# Altium project Pulp FMC Sensor Board_8X64Mbits_HyperRam.PrjPcb
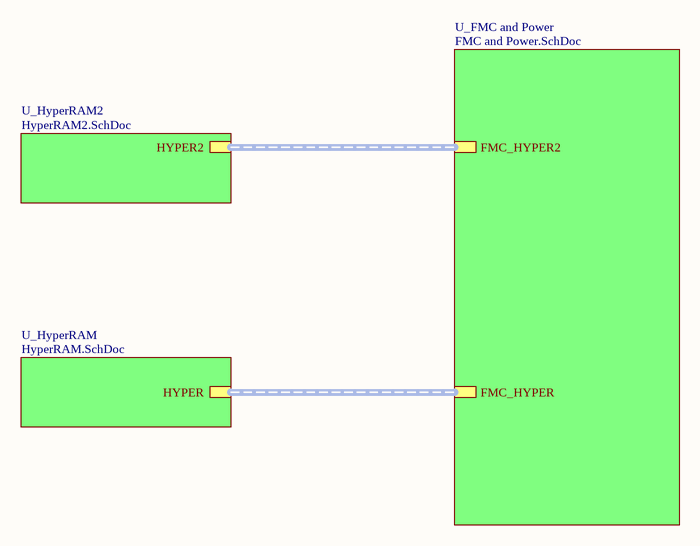
[diagram p0: Pulp FMC Sensor Board_8X64Mbits_HyperRam.SchDoc]
3 sheets, 36 parts. Net scope: hierarchical (ports join the sheet entries above them; power ports are global).
Board file: Pulp FMC Sensor Board_8X64Mbits_HyperRam.PcbDoc
Sheets:
  Pulp FMC Sensor Board_8X64Mbits_HyperRam.SchDoc
    U_HyperRAM = HyperRAM.SchDoc
    U_HyperRAM2 = HyperRAM2.SchDoc

## Sheet Pulp FMC Sensor Board_8X64Mbits_HyperRam.SchDoc: Pulp FMC Sensor Board_8X64Mbits_HyperRam
size A4; Author: A. Blanco Fontao; CompanyName: ETHZ; DrawnBy: A. Blanco Fontao; Organization: Microelectronics Design Center; Address1: Gloriastrasse 35; Address2: 8092 Zurich; Address3: Switzerland; SheetNumber: 1; SheetTotal: 7

### Sub-sheets
U_FMC and Power = FMC and Power.SchDoc (file not in this document): FMC_HYPER (harness HYPER), FMC_HYPER2
U_HyperRAM = HyperRAM.SchDoc: HYPER (harness HYPER)
U_HyperRAM2 = HyperRAM2.SchDoc: HYPER2

### Buses and harness runs
harness sheet U_FMC and Power/FMC_HYPER2 = sheet U_HyperRAM2/HYPER2
harness sheet U_FMC and Power/FMC_HYPER = sheet U_HyperRAM/HYPER

### Notes on the sheet
- 1
- 2
- 3
- 4
- A
- B
- C
- Project:
- D
- Date:
- Drawing number:
- Rev:
- Format:
- A4 Q
- Drawn by:
- Laboratory:
- Page
- Sheet:
- of
- File:

## Sheet HyperRAM.SchDoc: Pulp FMC Sensor Board
size A4; Author: A. Blanco Fontao; CompanyName: ETHZ; DrawnBy: A. Blanco Fontao; Organization: Microelectronics Design Center; Address1: Gloriastrasse 35; Address2: 8092 Zurich; Address3: Switzerland; SheetNumber: 4; SheetTotal: 7
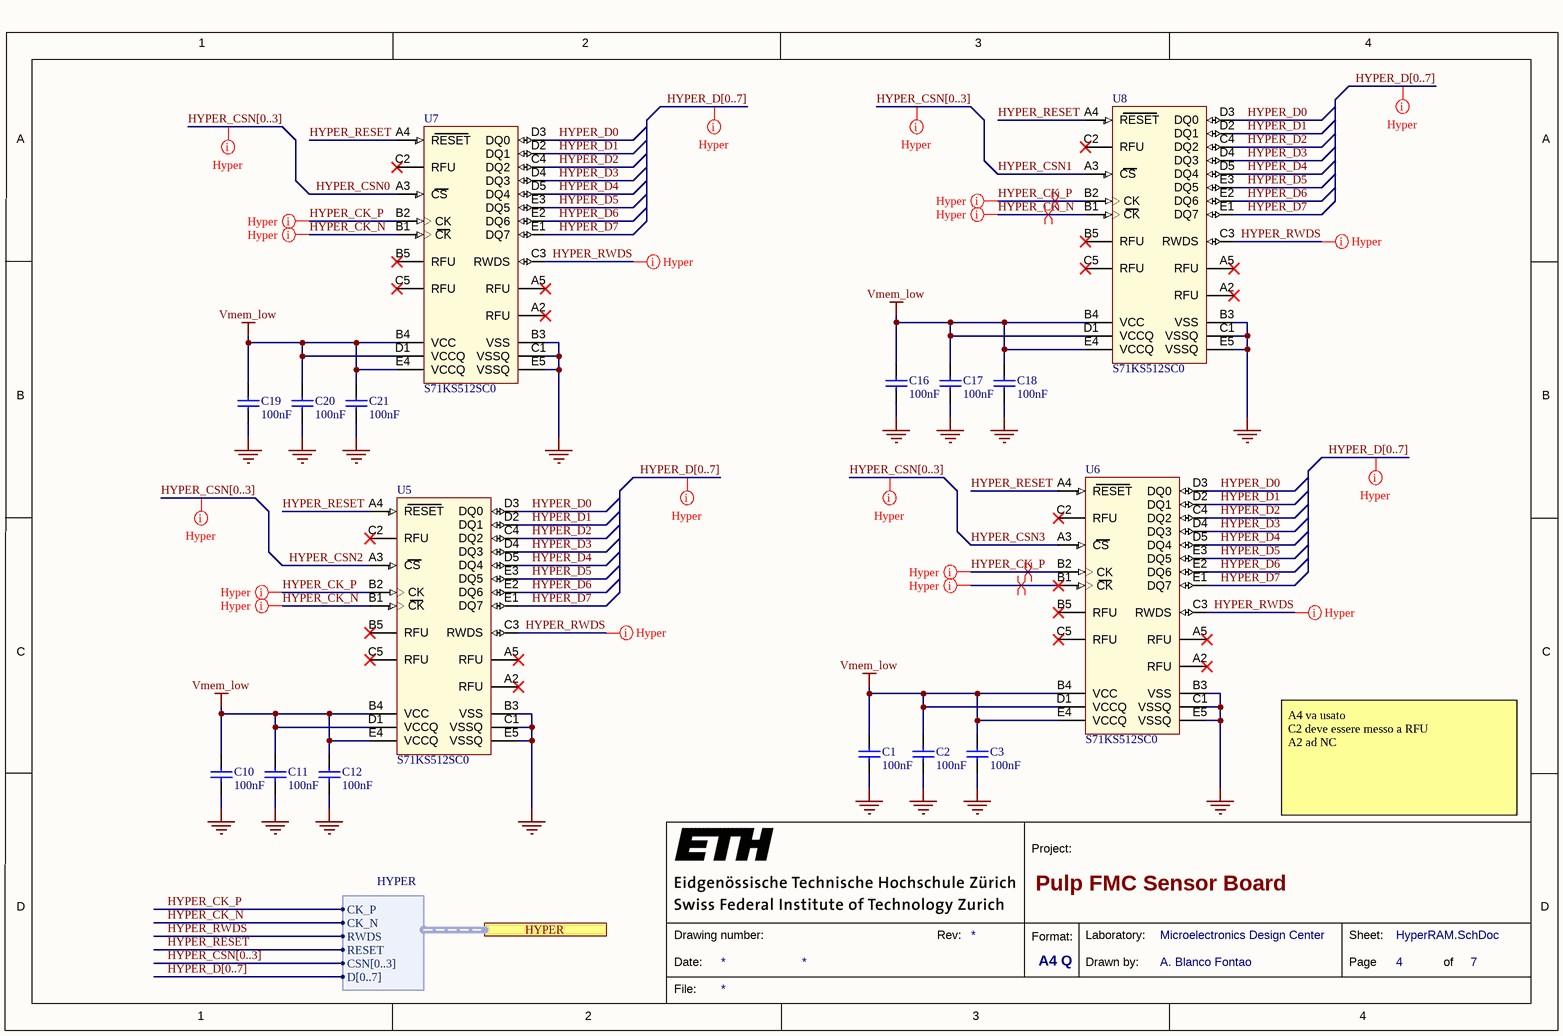
[diagram p1: HyperRAM.SchDoc]

### Parts
C1  value 100nF  [CAPC0603(1608)100_N]  (hidden comment: CAP 100nF 25V 0603(1608))
C2  value 100nF  [CAPC0603(1608)100_N]  (hidden comment: CAP 100nF 25V 0603(1608))
C3  value 100nF  [CAPC0603(1608)100_N]  (hidden comment: CAP 100nF 25V 0603(1608))
C10  value 100nF  [CAPC0603(1608)100_N]  (hidden comment: CAP 100nF 25V 0603(1608))
C11  value 100nF  [CAPC0603(1608)100_N]  (hidden comment: CAP 100nF 25V 0603(1608))
C12  value 100nF  [CAPC0603(1608)100_N]  (hidden comment: CAP 100nF 25V 0603(1608))
C16  value 100nF  [CAPC0603(1608)100_N]  (hidden comment: CAP 100nF 25V 0603(1608))
C17  value 100nF  [CAPC0603(1608)100_N]  (hidden comment: CAP 100nF 25V 0603(1608))
C18  value 100nF  [CAPC0603(1608)100_N]  (hidden comment: CAP 100nF 25V 0603(1608))
C19  value 100nF  [CAPC0603(1608)100_N]  (hidden comment: CAP 100nF 25V 0603(1608))
C20  value 100nF  [CAPC0603(1608)100_N]  (hidden comment: CAP 100nF 25V 0603(1608))
C21  value 100nF  [CAPC0603(1608)100_N]  (hidden comment: CAP 100nF 25V 0603(1608))
U5  S71KS512SC0  [FBGA24_A-130]
U6  S71KS512SC0  [FBGA24_A-130]
U7  S71KS512SC0  [FBGA24_A-130]
U8  S71KS512SC0  [FBGA24_A-130]

### Ports
HYPER (harness HYPER)

### Harnesses
HYPER: CK_N, CK_P, RWDS, CSN[0..3], D[0..7], RESET

### Nets
GND: C1.1 C2.1 C3.1 C10.1 C11.1 C12.1 C16.1 C17.1 C18.1 C19.1 C20.1 C21.1 U5.B3(VSS) U5.C1(VSSQ) U5.E5(VSSQ) U6.B3(VSS) U6.C1(VSSQ) U6.E5(VSSQ) U7.B3(VSS) U7.C1(VSSQ) U7.E5(VSSQ) U8.B3(VSS) U8.C1(VSSQ) U8.E5(VSSQ)
Vmem_low: C1.2 C2.2 C3.2 C10.2 C11.2 C12.2 C16.2 C17.2 C18.2 C19.2 C20.2 C21.2 U5.B4(VCC) U5.D1(VCCQ) U5.E4(VCCQ) U6.B4(VCC) U6.D1(VCCQ) U6.E4(VCCQ) U7.B4(VCC) U7.D1(VCCQ) U7.E4(VCCQ) U8.B4(VCC) U8.D1(VCCQ) U8.E4(VCCQ)
HYPER_CK_N: U5.B1(CK) U7.B1(CK) U8.B1(CK) ; port HYPER.CK_N
HYPER_CK_P: U5.B2(CK) U6.B2(CK) U7.B2(CK) U8.B2(CK) ; port HYPER.CK_P
HYPER_CSN0: U7.A3(CS)
HYPER_CSN1: U8.A3(CS)
HYPER_CSN2: U5.A3(CS)
HYPER_CSN3: U6.A3(CS)
HYPER_D0: U5.D3(DQ0) U6.D3(DQ0) U7.D3(DQ0) U8.D3(DQ0)
HYPER_D1: U5.D2(DQ1) U6.D2(DQ1) U7.D2(DQ1) U8.D2(DQ1)
HYPER_D2: U5.C4(DQ2) U6.C4(DQ2) U7.C4(DQ2) U8.C4(DQ2)
HYPER_D3: U5.D4(DQ3) U6.D4(DQ3) U7.D4(DQ3) U8.D4(DQ3)
HYPER_D4: U5.D5(DQ4) U6.D5(DQ4) U7.D5(DQ4) U8.D5(DQ4)
HYPER_D5: U5.E3(DQ5) U6.E3(DQ5) U7.E3(DQ5) U8.E3(DQ5)
HYPER_D6: U5.E2(DQ6) U6.E2(DQ6) U7.E2(DQ6) U8.E2(DQ6)
HYPER_D7: U5.E1(DQ7) U6.E1(DQ7) U7.E1(DQ7) U8.E1(DQ7)
HYPER_RESET: U5.A4(RESET) U6.A4(RESET) U7.A4(RESET) U8.A4(RESET) ; port HYPER.RESET
HYPER_RWDS: U5.C3(RWDS) U6.C3(RWDS) U7.C3(RWDS) U8.C3(RWDS) ; port HYPER.RWDS

Not connected (* = marked no-connect by the designer): U5 A2(RFU)* A5(RFU)* B5(RFU)* C2(RFU)* C5(RFU)*; U6 A2(RFU)* A5(RFU)* B1(CK)* B5(RFU)* C2(RFU)* C5(RFU)*; U7 A2(RFU)* A5(RFU)* B5(RFU)* C2(RFU)* C5(RFU)*; U8 A2(RFU)* A5(RFU)* B5(RFU)* C2(RFU)* C5(RFU)*

### Buses and harness runs
bus HYPER_CSN[0..3]
bus HYPER_D[0..7]

### Layout directives
net class Hyper: (no net found under the mark), HYPER_CK_N, HYPER_CK_P, HYPER_RWDS, NetU6_B1
differential pair: HYPER_CK_N, HYPER_CK_P, NetU6_B1

### Notes on the sheet
- A4 va usato
  C2 deve essere messo a RFU
  A2 ad NC
- 1
- 2
- 3
- 4
- A
- B
- C
- Project:
- D
- Date:
- Drawing number:
- Rev:
- Format:
- A4 Q
- Drawn by:
- Laboratory:
- Page
- Sheet:
- of
- File:

### Library data of the parts
C1-C3 C10-C12 C16-C21 = CMP-1035-02588-1: CAP 100nF 25V ±10% 0603 (1608 Metric) Thickness 1mm SMD; Case-Metric: 1608; Case-EIA: 0603; Tolerance: Â±10%; Max Thickness: 1 mm; Technology: SMT; Rated Voltage: 25 V
U5-U8 = S80KS5122: Cypress 64Mbit DRAM 24FBGA HyperRam; ComponentLink1Description: New link; ComponentLink1URL: https://www.mouser.it/ProductDetail/Infineon-Technologies/S80KS5122GABHV020?qs=doiCPypUmgEJDMhxR%2Fbnog%3D%3D

## Sheet HyperRAM2.SchDoc: Pulp FMC Sensor Board
size A4; Author: A. Blanco Fontao; CompanyName: ETHZ; DrawnBy: A. Blanco Fontao; Organization: Microelectronics Design Center; Address1: Gloriastrasse 35; Address2: 8092 Zurich; Address3: Switzerland; SheetNumber: 5; SheetTotal: 7
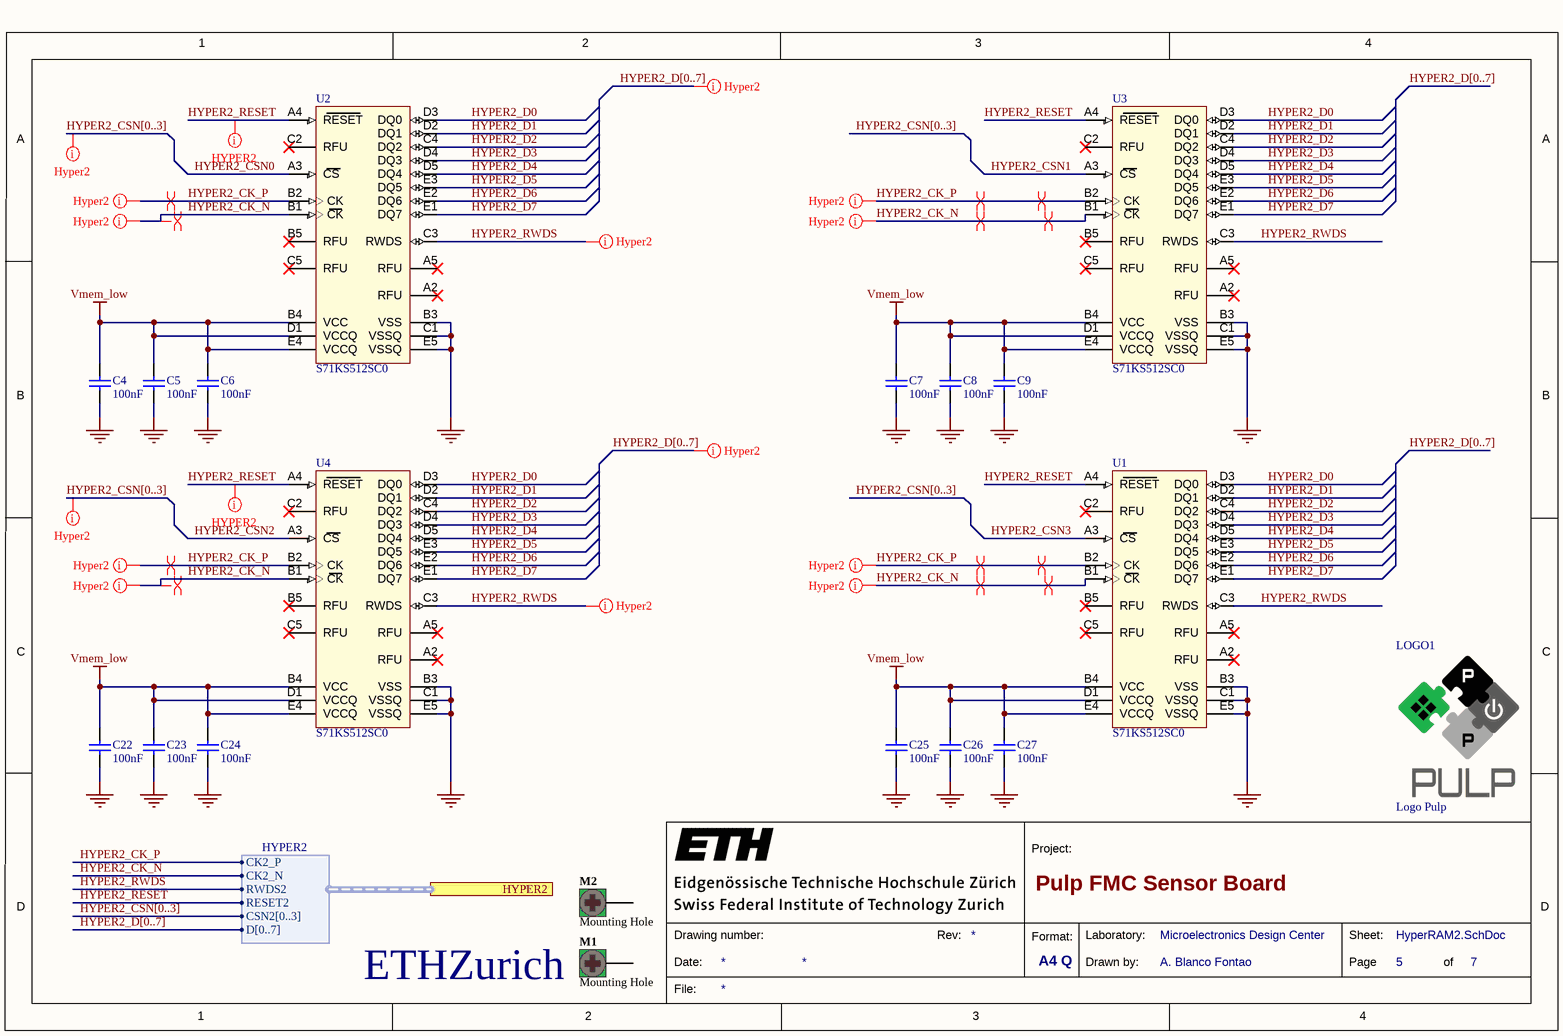
[diagram p2: HyperRAM2.SchDoc]

### Parts
A1  Logo ETH Zurich  [eth-zurich_3mm]  (value not drawn)  (no BOM)
C4  value 100nF  [CAPC0603(1608)100_N]  (hidden comment: CAP 100nF 25V 0603(1608))
C5  value 100nF  [CAPC0603(1608)100_N]  (hidden comment: CAP 100nF 25V 0603(1608))
C6  value 100nF  [CAPC0603(1608)100_N]  (hidden comment: CAP 100nF 25V 0603(1608))
C7  value 100nF  [CAPC0603(1608)100_N]  (hidden comment: CAP 100nF 25V 0603(1608))
C8  value 100nF  [CAPC0603(1608)100_N]  (hidden comment: CAP 100nF 25V 0603(1608))
C9  value 100nF  [CAPC0603(1608)100_N]  (hidden comment: CAP 100nF 25V 0603(1608))
C22  value 100nF  [CAPC0603(1608)100_N]  (hidden comment: CAP 100nF 25V 0603(1608))
C23  value 100nF  [CAPC0603(1608)100_N]  (hidden comment: CAP 100nF 25V 0603(1608))
C24  value 100nF  [CAPC0603(1608)100_N]  (hidden comment: CAP 100nF 25V 0603(1608))
C25  value 100nF  [CAPC0603(1608)100_N]  (hidden comment: CAP 100nF 25V 0603(1608))
C26  value 100nF  [CAPC0603(1608)100_N]  (hidden comment: CAP 100nF 25V 0603(1608))
C27  value 100nF  [CAPC0603(1608)100_N]  (hidden comment: CAP 100nF 25V 0603(1608))
LOGO1  Logo Pulp  [Logo Pulp]  (no BOM)
M1  Mounting Hole  [Hole M3]  (no BOM)
M2  Mounting Hole  [Hole M3]  (no BOM)
U1  S71KS512SC0  [FBGA24_A-130]
U2  S71KS512SC0  [FBGA24_A-130]
U3  S71KS512SC0  [FBGA24_A-130]
U4  S71KS512SC0  [FBGA24_A-130]

### Ports
HYPER2 (harness HYPER2)

### Harnesses
HYPER2: D[0..7], CK2_P, CK2_N, RWDS2, CSN2[0..3], RESET2

### Nets
GND: C4.1 C5.1 C6.1 C7.1 C8.1 C9.1 C22.1 C23.1 C24.1 C25.1 C26.1 C27.1 U1.B3(VSS) U1.C1(VSSQ) U1.E5(VSSQ) U2.B3(VSS) U2.C1(VSSQ) U2.E5(VSSQ) U3.B3(VSS) U3.C1(VSSQ) U3.E5(VSSQ) U4.B3(VSS) U4.C1(VSSQ) U4.E5(VSSQ)
Vmem_low: C4.2 C5.2 C6.2 C7.2 C8.2 C9.2 C22.2 C23.2 C24.2 C25.2 C26.2 C27.2 U1.B4(VCC) U1.D1(VCCQ) U1.E4(VCCQ) U2.B4(VCC) U2.D1(VCCQ) U2.E4(VCCQ) U3.B4(VCC) U3.D1(VCCQ) U3.E4(VCCQ) U4.B4(VCC) U4.D1(VCCQ) U4.E4(VCCQ)
HYPER2_CK_N: U1.B1(CK) U2.B1(CK) U3.B1(CK) U4.B1(CK) ; port HYPER2.CK2_N
HYPER2_CK_P: U1.B2(CK) U2.B2(CK) U3.B2(CK) U4.B2(CK) ; port HYPER2.CK2_P
HYPER2_CSN0: U2.A3(CS)
HYPER2_CSN1: U3.A3(CS)
HYPER2_CSN2: U4.A3(CS)
HYPER2_CSN3: U1.A3(CS)
HYPER2_D0: U1.D3(DQ0) U2.D3(DQ0) U3.D3(DQ0) U4.D3(DQ0)
HYPER2_D1: U1.D2(DQ1) U2.D2(DQ1) U3.D2(DQ1) U4.D2(DQ1)
HYPER2_D2: U1.C4(DQ2) U2.C4(DQ2) U3.C4(DQ2) U4.C4(DQ2)
HYPER2_D3: U1.D4(DQ3) U2.D4(DQ3) U3.D4(DQ3) U4.D4(DQ3)
HYPER2_D4: U1.D5(DQ4) U2.D5(DQ4) U3.D5(DQ4) U4.D5(DQ4)
HYPER2_D5: U1.E3(DQ5) U2.E3(DQ5) U3.E3(DQ5) U4.E3(DQ5)
HYPER2_D6: U1.E2(DQ6) U2.E2(DQ6) U3.E2(DQ6) U4.E2(DQ6)
HYPER2_D7: U1.E1(DQ7) U2.E1(DQ7) U3.E1(DQ7) U4.E1(DQ7)
HYPER2_RESET: U1.A4(RESET) U2.A4(RESET) U3.A4(RESET) U4.A4(RESET) ; port HYPER2.RESET2
HYPER2_RWDS: U1.C3(RWDS) U2.C3(RWDS) U3.C3(RWDS) U4.C3(RWDS) ; port HYPER2.RWDS2

Not connected (* = marked no-connect by the designer): M1 1; M2 1; U1 A2(RFU)* A5(RFU)* B5(RFU)* C2(RFU)* C5(RFU)*; U2 A2(RFU)* A5(RFU)* B5(RFU)* C2(RFU)* C5(RFU)*; U3 A2(RFU)* A5(RFU)* B5(RFU)* C2(RFU)* C5(RFU)*; U4 A2(RFU)* A5(RFU)* B5(RFU)* C2(RFU)* C5(RFU)*

### Buses and harness runs
bus HYPER2_CSN[0..3]
bus HYPER2_D[0..7]

### Layout directives
differential pair: HYPER2_CK_N, HYPER2_CK_P
mark named HYPER2: HYPER2_RESET
net class Hyper2: (no net found under the mark), HYPER2_CK_N, HYPER2_CK_P, HYPER2_RWDS

### Notes on the sheet
- 1
- 2
- 3
- 4
- A
- B
- C
- Project:
- D
- Date:
- Drawing number:
- Rev:
- Format:
- A4 Q
- Drawn by:
- Laboratory:
- Page
- Sheet:
- of
- File:
- (in symbol CMP-00038-1) ETHZurich

### Library data of the parts
A1 = CMP-00038-1
C4-C9 C22-C27 = CMP-1035-02588-1: as C1 on sheet HyperRAM; Max Thickness: 1 mm; Technology: SMT; Rated Voltage: 25 V
LOGO1 = CMP-00145-1: 4 Layers: only valid for layer stack as defined for the TestBoards
M1 M2 = CMP-00023-1: Mounting Hole, 7.2mm pad, 3.2mm plated hole; ClassName: Mounting Hole
U1-U4 = S80KS5122: Cypress 64Mbit DRAM 24FBGA HyperRam; ComponentLink1Description: New link; ComponentLink1URL: https://www.mouser.it/ProductDetail/Infineon-Technologies/S80KS5122GABHV020?qs=doiCPypUmgEJDMhxR%2Fbnog%3D%3D

## Nets that join several sheets
GND: HyperRAM (24 pins), HyperRAM2 (24 pins)
Vmem_low: HyperRAM (24 pins), HyperRAM2 (24 pins)